# Altium schematic sheet Power Distribution - Light Load.SchDoc
size Letter; Organization: Midnight Sun Solar Rayce Car Team; Address1: University of Waterloo; Address2: 200 University Ave W; Address3: Waterloo, ON, Canada; Address4: N2L 3E9; Website: www.uwmidsun.com
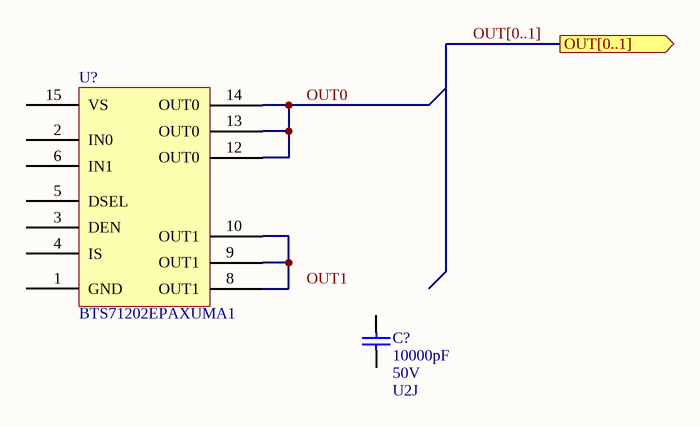
[diagram p0: Power Distribution - Light Load.SchDoc]

## Parts
C?  Capacitance: 10000pF  Voltage: 50V  Temperature Coefficient: U2J  [CAP, 0603]  (hidden comment: CAP CER 10nF 50V 5% X7R 0603)
U?  Manufacturer Part Number: BTS71202EPAXUMA1  [IC LOAD SWITCH PG-TSDSO-14-22]  (hidden comment: IC LOAD SWITCH BTS7120-2EPA PG-TSDSO-14)

## Ports
OUT[0..1] (out)

## Nets
OUT0: U?.12(OUT0) U?.13(OUT0) U?.14(OUT0)
NetU?_8: U?.8(OUT1) U?.9(OUT1) U?.10(OUT1)

Not connected (* = marked no-connect by the designer): C? 1 2; U? 1(GND) 2(IN0) 3(DEN) 4(IS) 5(DSEL) 6(IN1) 15(VS)

## Buses and harness runs
bus OUT[0..1] = port OUT[0..1]

## Notes on the sheet
- Labels drawn without touching a wire or pin: OUT1
- Project:
- Title:
- Size:
- Project Author
- Letter
- Revision:
- University of Waterloo
- 200 University Ave W
- Waterloo, ON, Canada
- N2L 3E9
- Date:
- Sheet
- of
- Website:

## Library data of the parts
C? = CAP CER 10nF 50V 5% X7R 0603: 10000pF ±5% 50V Ceramic Capacitor U2J 0603 (1608 Metric); Manufacturer 1: KEMET; Manufacturer Part Number 1: C0603C103J5JAC7867; Supplier 1: Digi-Key; Supplier Part Number 1: 399-13384-1-ND; Packaging: Cut Tape (CT); Part Status: Active; Operating Temperature: -55°C ~ 125°C; Ratings: -; Failure Rate: -; Mounting Type: Surface Mount, MLCC; Package / Case: 0603 (1608 Metric); Size / Dimension: 0.063" L x 0.032" W (1.60mm x 0.80mm); Height - Seated (Max): -; Thickness (Max): 0.034" (0.87mm); Lead Spacing: -; Lead Style: -; ComponentLink1URL: http://www.kemet.com/docfinder?Partnumber=C0603C103J5JAC7867; ComponentLink1Description: http://www.kemet.com/docfinder?Partnumber=C0603C103J5JAC7867; Tolerance: ±5%
U? = IC LOAD SWITCH BTS7120-2EPA PG-TSDSO-14: Power Switch/Driver 1:1 N-Channel 2A PG-TSDSO-14-22; Manufacturer: Infineon; ComponentLink1URL: http://www.mouser.com/ds/2/308/NCP45520-D-211422.pdf; ComponentLink1Description: http://www.mouser.com/ds/2/308/NCP45520-D-211422.pdf; ComponentLink2URL: http://www.onsemi.com/pub/Collateral/NCP45520-D.PDF; ComponentLink2Description: http://www.onsemi.com/pub/Collateral/NCP45520-D.PDF; Supplier 1: Digi-Key; Stock 1: 2950; Pricing 1: 1 = 1.47000, 10 = 1.31000, 100 = 1.02140, 500 = 0.84372, 1000 = 0.66610 (USD); RoHS: No; Supplier Part Number 1: BTS71202EPAXUMA1CT-ND